# Altium schematic sheet 05-PMC.SchDoc: PMC
size A4; DocumentNumber: 5; SheetNumber: 5; SheetTotal: 5
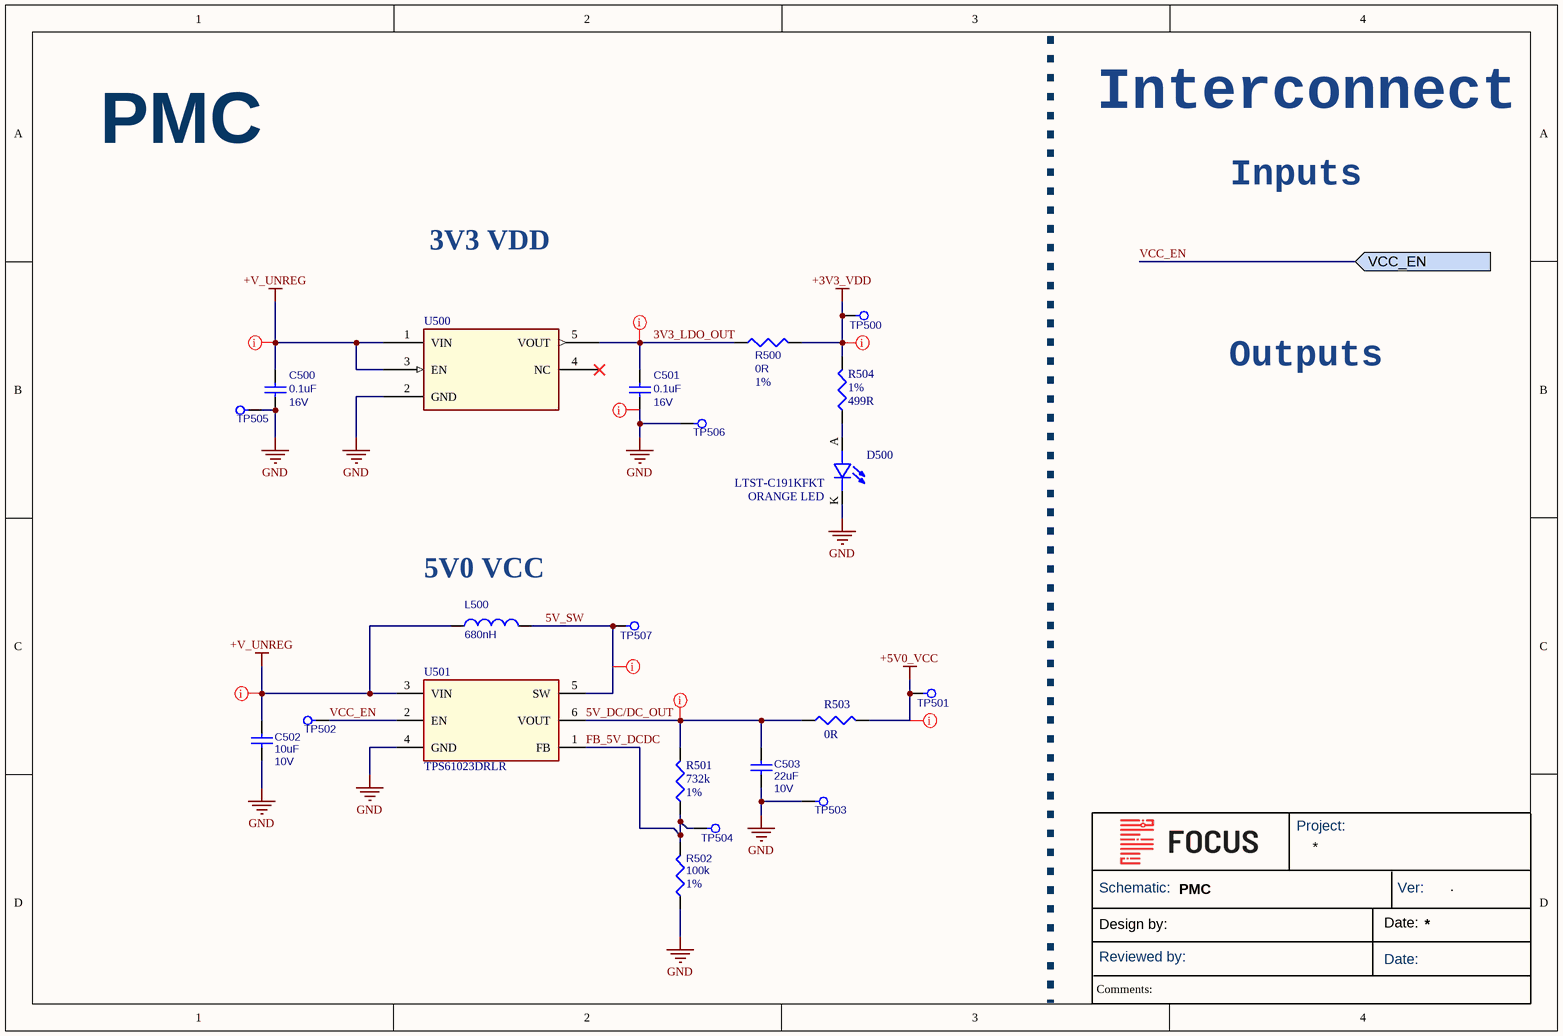
[diagram p0: 05-PMC.SchDoc]

## Parts
C500  value 0.1uF  Rating: 16V  [C0402]  (hidden comment: GCM155R71C104KA55)
C501  value 0.1uF  Rating: 16V  [C0402]  (hidden comment: GCM155R71C104KA55)
C502  value 10uF  Rating: 10V  [C0402]  (hidden comment: ZRB15XR61A106ME01D)
C503  value 22uF  Rating: 10V  [C0603]  (hidden comment: GRM188R61A226ME15D)
D500  LTST-C191KFKT  value ORANGE LED  [LEDC0603]
L500  value 680nH  [XAL4020-401MEC]  (hidden comment: XGL4015-681MEC)
R500  value 0R  Tolerance: 1%  [R0402]  (hidden comment: ERJ-2GE0R00X)
R501  value 732k  Tolerance: 1%  [R0402]  (hidden comment: CRCW0402732KFKED)
R502  value 100k  Tolerance: 1%  [R0402]  (hidden comment: ERJ-2RKF1003X)
R503  value 0R  [R0805]  (hidden comment: RCS08050000Z0EA)
R504  value 499R  Tolerance: 1%  [R0402]  (hidden comment: CRCW0402499RFKEDHP)
TP500  Test Point  [testpad_0.9mm]  (value not drawn)  (no BOM)
TP501  Test Point  [testpad_0.9mm]  (value not drawn)  (no BOM)
TP502  Test Point  [testpad_0.9mm]  (value not drawn)  (no BOM)
TP503  Test Point  [testpad_0.9mm]  (value not drawn)  (no BOM)
TP504  Test Point  [testpad_0.9mm]  (value not drawn)  (no BOM)
TP505  Test Point  [testpad_0.9mm]  (value not drawn)  (no BOM)
TP506  Test Point  [testpad_0.9mm]  (value not drawn)  (no BOM)
TP507  Test Point  [testpad_0.9mm]  (value not drawn)  (no BOM)
U500  AP7354-33W5-7  [SOT25_AP7354_DIO-L]  (value not drawn)
U501  TPS61023DRLR  [DRL0006A]

## Ports
VCC_EN (in)

## Nets
+3V3_VDD: R500.2 R504.2 TP500.1
+5V0_VCC: R503.2 TP501.1
+V_UNREG: C500.1 C502.2 L500.1 U500.1(VIN) U500.3(EN) U501.3(VIN)
GND: C500.2 C501.2 C502.1 C503.1 D500.K R502.1 TP503.1 TP505.1 TP506.1 U500.2(GND) U501.4(GND)
3V3_LDO_OUT: C501.1 R500.1 U500.5(VOUT)
5V_DC/DC_OUT: C503.2 R501.2 R503.1 U501.6(VOUT)
5V_SW: L500.2 TP507.1 U501.5(SW)
FB_5V_DCDC: R501.1 R502.2 TP504.1 U501.1(FB)
VCC_EN: TP502.1 U501.2(EN) ; port VCC_EN
NetD500_A: D500.A R504.1

Not connected (* = marked no-connect by the designer): U500 4(NC)*

## Layout directives
net class POWER; rule Supply Nets [Voltage = 3.300]: 3V3_LDO_OUT, +3V3_VDD
net class POWER; Voltage: 3.7V or 5V: +V_UNREG
net class POWER; rule Supply Nets [Voltage = 5.000]: 5V_DC/DC_OUT, +5V0_VCC
net class POWER; rule Supply Nets [Voltage = 0.000]: GND
net class POWER: 5V_SW

## Notes on the sheet
- PMC
- Interconnect
- Inputs
- 3V3 VDD
- Outputs
- (near L500) 5V0 VCC
- Project:
- Schematic:
- Ver:
- .
- Design by:
- Reviewed by:
- Date:
- Comments:

## Library data of the parts
C500 C501 = GCM155R71C104KA55: Capacitor, 0.1uF, X7R, 16V, 10%, 0402, Implant-grade; Manufacturer: Murata; Medical Grade MFR PN: GCH155R71C104KE01; PCB Footprint: cap0402_reduced; Length (mm): 1.00 ±0.05; Manufacturer Part Number: GCM155R71C104KA55; Medical Grade MFR: Murata; Thickness (mm): 0.50 ±0.05; Width (mm): 0.50 ±0.05; Category: Capacitor; Package Description: 0402; Supplier 1: Digikey; Supplier Part Number 1: 490-4759-1-ND
C502 = ZRB15XR61A106ME01D: Capacitor, 10uf, X5R, 10V, 20%, 0402, Implant-grade; Manufacturer: Murata; Medical Grade MFR: TBD; PCB Footprint: cap0402_reduced; Length (mm): 1.00 ±0.22; Manufacturer Part Number: ZRB15XR61A106ME01D; Medical Grade MFR PN: TBD; Thickness (mm): 0.65 ±0.2; Width (mm): 0.50 ±0.2; Category: Capacitor; Package Description: 0402; Check: *; Status: *; Review: *; Supplier 1: Future Electronics; Supplier Part Number 1: 2114729
C503 = GRM188R61A226ME15D: 22 µF ±20% 10V Ceramic Capacitor X5R 0603 (1608 Metric); Manufacturer: Murata; PCB Footprint: cap0603_reduced; Length (mm): 1.60 ±0.10; Manufacturer Part Number: GRM188R61A226ME15D; Thickness (mm): 0.80 ±0.10; Width (mm): 0.80 ±0.10; Category: Capacitor; Package Description: 0603; Supplier 1: Digikey; Supplier Part Number 1: 490-10476-1-ND
D500 = LED ORANGE CLEAR SMD 0603: LED, ORANGE, SMD, 0603, 2V, 30mA; Manufacturer: Lite-On Inc.; Power Rating: 75mW; Wavelength: 605nm; Category: LED; Manufacturer Part Number: LTST-C191KFKT; Size Code: 0603; Supplier: Digi-Key; Supplier Part Number: 160-1445-2-ND; Height: 0.55mm; Width: 0.80mm; Length: 1.60mm; Forward Voltage: 2V; Forward Current: 30mA; Supplier 1: Digikey; Supplier Part Number 1: 160-1445-2-ND
L500 = XGL4015-681MEC: 680 nH Shielded Molded Inductor 8.1 A 10.1mOhm Max 1616 (4040 Metric); Manufacturer: Coilcraft; Rating: 8.1A; Manufacturer Part Number: XGL4015-681MEC; Category: Inductor; Supplier 1: Digikey; Supplier Part Number 1: 2457-XGL4015-681MEC-ND
R500 = ERJ-2GE0R00X: Resistor, Zero ohms, 40V, 40mW, 1%, 0402, Implant-grade; Manufacturer: Panasonic; Medical Grade MFR: Mini-Systems; Medical Grade MFR PN: WAJ20PG-NS62TRX; PCB Footprint: res0402_reduced; Review: 020823; Length (mm): 1.12 ±0.10; Rating: 40V; Thickness (mm): 0.33 ±0.08; Width (mm): 0.56 ±0.08; Category: Resistor; Package Description: TBD; Supplier 1: Mouser; Supplier Part Number 1: 667-ERJ-2GE0R00X; Status: Approved; Manufacturer Part Number: ERJ-2GE0R00X
R501 = CRCW0402732KFKED: 732 kOhms ±1% 0.063W, 1/16W Chip Resistor 0402 (1005 Metric) Automotive AEC-Q200 Thick Film; Manufacturer: Vishay Dale; Power: 63mW; Temperature Coefficient: ±100ppm/°C; Category: Resistor; Manufacturer Part Number: CRCW0402732KFKED; Size Code: 0402; Height: 0.40mm; Width: 0.50mm; Length: 1.00mm; Supplier 1: Digikey; Supplier Part Number 1: 541-732KLCT-ND
R502 = ERJ-2RKF1003X: Resistor, 100k, 1%, 0402, Implant-grade; Manufacturer: Panasonic; Medical Grade MFR: Mini-Systems; Medical Grade MFR PN: WA20SM-1003F-NS62TRX; PCB Footprint: res0402_reduced; Rating: 40V; Review: 020823; Length (mm): 1.12 ±0.10; Thickness (mm): 0.33 ±0.08; Width (mm): 0.56 ±0.08; Category: Resistor; Supplier 1: Mouser; Supplier Part Number 1: 667-ERJ-2RKF1003X; Status: Approved; Manufacturer Part Number: ERJ-2RKF1003X
R503 = RCS08050000Z0EA: 0 Ohms Jumper Chip Resistor 0805 (2012 Metric) Automotive AEC-Q200, Pulse Withstanding Thick Film; Manufacturer: Vishay Dale; Power Rating: 500mW; Resistance: 0mR; Voltage Rating (DC): 150V; Depth: 1.25mm; Height: 0.5mm; Number of Pins: 2; Max Operating Temperature: 155°C; Mount: Surface Mount; Radiation Hardening: No; Width: 2mm; Composition: Thick Film; Case/Package: 0805; Min Operating Temperature: -55°C; Termination: SMD/SMT; Manufacturer Part Number: RCS08050000Z0EA; Category: Chip SMD Resistors; ComponentLink1URL: https://datasheet.ciiva.com/11809/0900766b80fcdb72-11809586.pdf?src-supplier=Rs; ComponentLink1Description: https://datasheet.ciiva.com/11809/0900766b80fcdb72-11809586.pdf?src-supplier=Rs; ComponentLink2URL: https://datasheet.ciiva.com/7001/1902866-7001645.pdf?src-supplier=Newark; ComponentLink2Description: https://datasheet.ciiva.com/7001/1902866-7001645.pdf?src-supplier=Newark; ComponentLink3URL: https://datasheet.ciiva.com/7986/691949-7986171.pdf?src-supplier=Element14; ComponentLink3Description: https://datasheet.ciiva.com/7986/691949-7986171.pdf?src-supplier=Element14; ComponentLink4URL: https://datasheet.ciiva.com/7660/1856384-7660956.pdf?src-supplier=Element14; ComponentLink4Description: https://datasheet.ciiva.com/7660/1856384-7660956.pdf?src-supplier=Element14; ComponentLink5URL: https://datasheet.ciiva.com/22693/1902866-22693213.pdf?src-supplier=Element14; ComponentLink5Description: https://datasheet.ciiva.com/22693/1902866-22693213.pdf?src-supplier=Element14; ComponentLink6URL: https://datasheet.ciiva.com/5545/chpreztr-5545708.pdf?src-supplier=Mouser; ComponentLink6Description: https://datasheet.ciiva.com/5545/chpreztr-5545708.pdf?src-supplier=Mouser; ComponentLink7URL: https://datasheet.ciiva.com/16761/70154685-16761515.pdf?src-supplier=Allied+Electronics; ComponentLink7Description: https://datasheet.ciiva.com/16761/70154685-16761515.pdf?src-supplier=Allied+Electronics; ComponentLink8URL: https://datasheet.ciiva.com/30062/159chpreztr-30062601.pdf?src-supplier=Onlinecomponents.com; ComponentLink8Description: https://datasheet.ciiva.com/30062/159chpreztr-30062601.pdf?src-supplier=Onlinecomponents.com; ComponentLink9URL: https://datasheet.ciiva.com/48692/001055497-da-01-en-smd-wid-cr0603-j-000elf-0-0-ohm-1-10w-48692135.pdf?src-supplier=Conrad; ComponentLink9Description: https://datasheet.ciiva.com/48692/001055497-da-01-en-smd-wid-cr0603-j-000elf-0-0-ohm-1-10w-48692135.pdf?src-supplier=Conrad; ComponentLink10URL: https://datasheet.ciiva.com/11811/0900766b80d98b26-11811304.pdf?src-supplier=Rs; ComponentLink10Description: https://datasheet.ciiva.com/11811/0900766b80d98b26-11811304.pdf?src-supplier=Rs; ComponentLink11URL: https://datasheet.ciiva.com/2463/dcrcwe3-2463037.pdf?src-supplier=Digi-Key; ComponentLink11Description: https://datasheet.ciiva.com/2463/dcrcwe3-2463037.pdf?src-supplier=Digi-Key; ComponentLink12URL: https://datasheet.ciiva.com/2463/dcrcwe3-2463038.pdf?src-supplier=Digi-Key; ComponentLink12Description: https://datasheet.ciiva.com/2463/dcrcwe3-2463038.pdf?src-supplier=Digi-Key; ComponentLink13URL: https://datasheet.ciiva.com/2463/dcrcwe3-2463039.pdf?src-supplier=Digi-Key; ComponentLink13Description: https://datasheet.ciiva.com/2463/dcrcwe3-2463039.pdf?src-supplier=Digi-Key; ComponentLink14URL: https://datasheet.ciiva.com/5543/dcrcwe3-109170-5543096.pdf?src-supplier=Mouser; ComponentLink14Description: https://datasheet.ciiva.com/5543/dcrcwe3-109170-5543096.pdf?src-supplier=Mouser; ComponentLink15URL: https://datasheet.ciiva.com/16389/dcrcwe3-16389338.pdf?src-supplier=Future+Electronics; ComponentLink15Description: https://datasheet.ciiva.com/16389/dcrcwe3-16389338.pdf?src-supplier=Future+Electronics; ComponentLink16URL: https://datasheet.ciiva.com/7841/1697337-7841629.pdf?src-supplier=Element14; ComponentLink16Description: https://datasheet.ciiva.com/7841/1697337-7841629.pdf?src-supplier=Element14; ComponentLink17URL: https://datasheet.ciiva.com/7841/1720486-7841839.pdf?src-supplier=Element14; ComponentLink17Description: https://datasheet.ciiva.com/7841/1720486-7841839.pdf?src-supplier=Element14; ComponentLink18URL: https://datasheet.ciiva.com/26314/fld-crcw-e3-data-en-26314630.pdf?src-supplier=Distrelec; ComponentLink18Description: https://datasheet.ciiva.com/26314/fld-crcw-e3-data-en-26314630.pdf?src-supplier=Distrelec; ComponentLink19URL: https://datasheet.ciiva.com/16719/70201119-16719706.pdf?src-supplier=Allied+Electronics; ComponentLink19Description: https://datasheet.ciiva.com/16719/70201119-16719706.pdf?src-supplier=Allied+Electronics; Supplier 1: Digikey; Supplier Part Number 1: 541-2827-1-ND
R504 = CRCW0402499RFKEDHP: Fixed Resistor, Metal Glaze/thick Film, 0.2W, 499ohm, 50V, 1% +/-Tol, 100ppm/Cel, Surface Mount, 0402; Manufacturer: Vishay Dale; Manufacturer Series: CRCW-HPE3; Medical Grade MFR: TBD; Power: 200mW; Rated Temperature: 70°C; Temperature Coefficient: 100ppm/°C; Package Height: 0.3mm; Package Length: 1mm; Package Width: 0.5mm; Reference Standard: AEC-Q200; Supplier: Digikey; Supplier Part Number: 541-499YCT-ND; Manufacturer Part Number: CRCW0402499RFKEDHP; RoHS: Yes; Category: Chip SMD Resistors; Stock: 50100; Pricing: 1=0.13, 10=0.061, 50=0.0402, 100=0.0341, 500=0.024, 1000=0.02091, 5000=0.01572 (USD); Mounting Technology: Surface Mount; Pins: 2; Package Shape: Rectangular; Case/Package: 0402; Terminal Finish: Nickel; Min Operating Temperature: -55°C; Max Operating Temperature: 155°C; JESD-609 Code: e3; Resistor Type: FIXED RESISTOR; Construction: Chip; Package Style: SMTMeter; Packaging: Tape and Reel; Series: CRCW-HP E3; Technology: METAL GLAZE/THICK FILM; Termination: Wraparound; Working Voltage: 50V; Reach SVHC Compliant: Yes; RoHS Compliant: Yes; ComponentLink1URL: https://datasheet.ciiva.com:443/pdfs/VipMasterIC/IC/VISH/VISH-S-A0009391795/VISH-S-A0009391795-1.pdf?src-supplier=IHS+Markit; ComponentLink1Description: https://datasheet.ciiva.com:443/pdfs/VipMasterIC/IC/VISH/VISH-S-A0009391795/VISH-S-A0009391795-1.pdf?src-supplier=IHS+Markit; ComponentLink2URL: https://datasheet.ciiva.com/5540/crcwhpe3-46056-5540816.pdf?src-supplier=Mouser; ComponentLink2Description: https://datasheet.ciiva.com/5540/crcwhpe3-46056-5540816.pdf?src-supplier=Mouser; ComponentLink3URL: https://datasheet.ciiva.com/8932/crcwhpe3-8932421.pdf?src-supplier=Avnet; ComponentLink3Description: https://datasheet.ciiva.com/8932/crcwhpe3-8932421.pdf?src-supplier=Avnet; Supplier 1: Mouser; Supplier Part Number 1: 71-CRCW0402499RFKEDH; Medical Grade MFR PN: TBD
TP500-TP507 = Test Point: Test pad, 0.90mm circular pad; PCB Footprint: testpad_0p90mm; Length (mm): 0.90; Manufacturer: N/A; Manufacturer PN: N/A; Medical Grade MFR: N/A; Medical Grade MFR PN: N/A; Rating: N/A; Thickness (mm): N/A; Value: Test point; Width (mm): 0.90; Category: Test point; Status: *; Review: *
U500 = AP7354-33W5-7: Ldo, Fixed, 3.3V, 0.15A, -40 To 85Deg C Rohs Compliant: Yes; Manufacturer: Diodes Inc; Output Configuration: Positive; Number of Regulators: 1; Max Input Voltage: 5.5V; Dropout Voltage: 350mV; Output Current: 150mA; Quiescent Current: 600nA; Supplier 1: Digi-Key; Manufacturer Part Number: AP7354-33W5-7; RoHS: Yes; Stock 1: 121726; Pricing 1: 1=0.52000, 10=0.44400, 25=0.41440, 100=0.33150, 250=0.30784, 500=0.26048, 1000=0.20128 (USD); Mount: Surface Mount; Case/Package: SOT-25; Min Operating Temperature: -40°C; Max Operating Temperature: 85°C; Output Type: Fixed; Packaging: Cut Tape; Min Output Voltage: 3.3V; RoHS Compliant: Yes; ComponentLink1URL: https://www.diodes.com/assets/Datasheets/AP7354.pdf?src-supplier=Digi-Key; ComponentLink1Description: https://www.diodes.com/assets/Datasheets/AP7354.pdf?src-supplier=Digi-Key; Supplier Part Number 1: AP7354-33W5-7DICT-ND
U501 = TPS61023DRLR: Boost Switching Regulator IC Positive Adjustable 2.2V 1 Output 3A SOT-563, SOT-666; Manufacturer: Texas Instruments; Input Range: 0.5V-5.5V; Output: 2.2V-5.5V; Number of outputs: 1; Switching Frequency: 1MHz; Category: Switched Regulator; Manufacturer Part Number: TPS61023DRLR; Output Type: Adjustable; Output Current: 3A; Topology: Boost; Supplier 1: Digikey; Supplier Part Number 1: 296-TPS61023DRLRCT-ND